# Altium schematic sheet power.SchDoc
size 209 x 297 mm
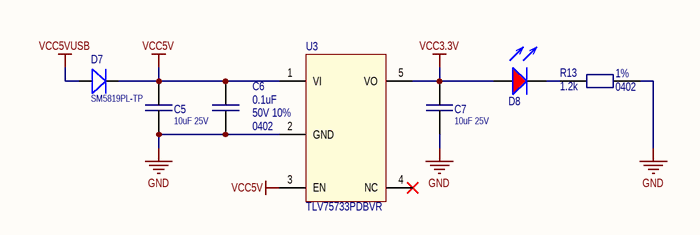
[diagram p0: power.SchDoc]

## Parts
C5  10uF 25V  [C_0603]
C6  value 0.1uF  Case/Package: 0402  Tolerance: 50V 10%  [C_0402]  (hidden comment: C0402)
C7  10uF 25V  [C_0603]
D7  SM5819PL-TP  [SOD123FL]
D8  Red 645nm  [LED 0603 RED, 60°]  (value not drawn)
R13  value 1.2k  Case/Package: 0402  Tolerance: 1%  [R_0402]  (hidden comment: R0402)
U3  TLV75733PDBVR  [SOT23-5]

## Nets
GND: C5.1 C6.1 C7.1 R13.1 U3.2(GND)
VCC3.3V: C7.2 D8.2 U3.5(VO)
VCC5V: C5.2 C6.2 D7.2(K) U3.1(VI) U3.3(EN)
VCC5VUSB: D7.1(A)
NetD8_1: D8.1 R13.2

Not connected (* = marked no-connect by the designer): U3 4(NC)*

## Library data of the parts
C5 C7 = C0603: Capacitor; Part: CC0603MRX5R8BB106; Value: 10uF 25V
C6 = C0402: Capacitor; Part: CC0402KRX5R9BB104; Alternative Part: *
D7 = D_SOD123: Diode; Part: SM5819PL-TP; Alternative Part: *
D8 = RED-LED-0603: RED LED 0603, 60°; Part: APTD1608LSURCK; Color: Red 645nm; Alternative Part: *
R13 = R0402: Resistor; Part: RC0402FR-071K2L; Alternative Part: *
U3 = TPL720F33-5TR: Ultra-Low Quiescent Current LDO; Part: TLV75733PDBVR